# Altium project BMSV2.PrjPcb
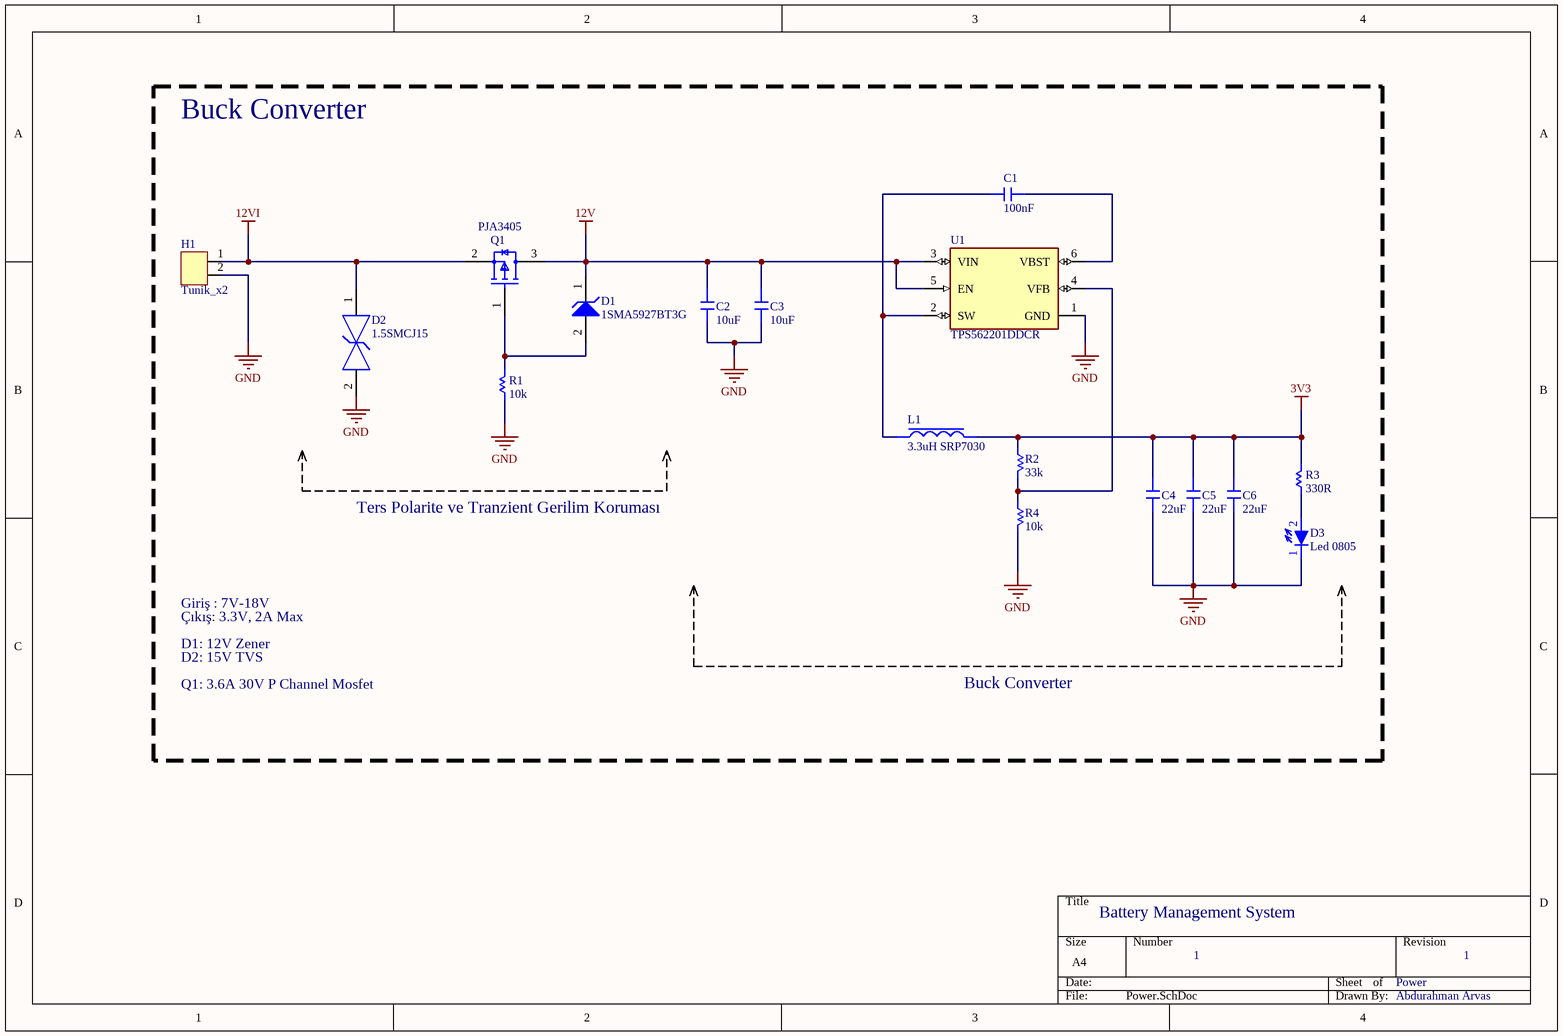
[diagram p0: Power.SchDoc]
5 sheets, 112 parts. Net scope: flat (ports and power ports of the same name join across sheets).
Board file: BMSV2.PcbDoc
Sheets:
  Power.SchDoc
  MCU.SchDoc
  Voltage_Measurement.SchDoc
  Overcurrent_Protection.SchDoc
  Cell_Balancing.SchDoc

## Sheet Power.SchDoc
size A4; SheetNumber: 1; SheetTotal: 5

### Parts
C1  100nF  [C0805]
C2  10uF  [C0805]
C3  10uF  [C0805]
C4  22uF  [C0805]
C5  22uF  [C0805]
C6  22uF  [C0805]
D1  1SMA5927BT3G  [ONSC-SMA-2-403D-02_F_V]
D2  1.5SMCJ15  [FP-SMC-MFG]
D3  Led 0805  [LED_0805]
H1  Tunik_x2  [2li_Tunik]
L1  3.3uH SRP7030  [Fıxed_Inductor_7.3x7x3]
Q1  PJA3405  [FP-SOT23-MFG]
R1  10k  [R0805]
R2  33k  [R0805]
R3  330R  [R0805]
R4  10k  [R0805]
U1  TPS562201DDCR  [FP-DDC0006A-IPC_A]

### Nets
3V3: C4.2 C5.2 C6.2 L1.2 R2.1 R3.2
12V: C2.2 C3.2 D1.1(K) Q1.3(D) U1.3(VIN) U1.5(EN)
12VI: D2.1 H1.1 Q1.2(S)
GND: C2.1 C3.1 C4.1 C5.1 C6.1 D2.2 D3.1(Cathode) H1.2 R1.1 R4.2 U1.1(GND)
NetC1_1: C1.1 U1.6(VBST)
NetC1_2: C1.2 L1.1 U1.2(SW)
NetD1_2: D1.2(A) Q1.1(G) R1.2
NetD3_2: D3.2(Anode) R3.1
NetR2_2: R2.2 R4.1 U1.4(VFB)

### Notes on the sheet
- Buck Converter
- Ters Polarite ve Tranzient Gerilim Koruması
- Giriş : 7V-18V
- Çıkış: 3.3V, 2A Max
- D1: 12V Zener
- D2: 15V TVS
- Q1: 3.6A 30V P Channel Mosfet
- Battery Management System
- 1
- Power
- Abdurahman Arvas

### Library data of the parts
C1-C6 = SMD_Capacitor
D1 = CMP-1060-00103-1: 1.5 W Zener Voltage Regulator, 2-Pin SMA, Pb-Free, Tape and Reel; Manufacturer: On Semiconductor; VZ Typ (V): 12; DatasheetVersion: Rev. 8; Mounting Technology: Surface Mount; RoHS: Pb-Free; Packing: Tape and Reel; ComponentLink2Description: Datasheet; ComponentLink1URL: http://www.onsemi.com/; PackageDescription: 2-Pin Small Molded Package, J-Bend Lead, Body 2.605 x 4.315 mm; PackageReference: SMA-2-403D-02_F; PartNumber: 1SMA5927BT3G; ComponentLink3URL: http://www.onsemi.com/pub_link/Collateral/1SMA5913BT3-D.PDF; ComponentLink1Description: Manufacturer URL; ComponentLink2URL: http://www.onsemi.com/pub_link/Collateral/1SMA5913BT3-D.PDF; PackageVersion: Rev. F, 11/2008; ComponentLink3Description: Package Specification
D2 = CMP-12225-000018-1: TVS DIODE 12V 19.9V SMC; Manufacturer: STMicroelectronics; Manufacturer Part Number: SMC30J12CA; Peak Pulse Power: 3000W; Number Of Channels: 1; Standoff Height: 0.05mm; Breakdown Voltage: 13.3V; Peak Pulse Current: 151A; Direction: Bidirectional; Max Junction Temp: +175°C; Temperature Range Low: -55°C; Package: SMC; Temperature Range High: +175°C; ComponentLink2Description: Datasheet; Temperature: -55°C to +175°C; Digikey Description: TVS DIODE 12V 19.9V SMC; Device Class L3: unset; Category: Diode; Reverse Standoff Voltage: 12V; Height: 2.65mm; Device Class L1: Circuit Protection; ComponentLink2URL: https://www.st.com/resource/en/datasheet/smc30j.pdf; Device Class L2: TVS Diodes; Automotive: No; Lead Free: Yes; Clamping Voltage: 19.9V; RoHS: TRUE; Octopart: https://octopart.com/smc30j12ca-stmicroelectronics-21709983
D3 = Led 0805: Light Emitting Diode with 0805 Footprint.
H1 = 2Li_Tunik: Value: 2 pin; Datasheet: https://cdn.ozdisan.com/ETicaret_Dosya/34800_4832773.pdf; Buy Link: https://ozdisan.com/konnektor-ve-baglanti-elemanlari/konnektor-cesitleri/pcb-konnektorler/TMK2002
L1 = Fixed_Inductor: Fixed Inductor
Q1 = CMP-12801-000074-1: MOSFET P-CH 60V 0.9A SOT23-3; Current Rating: -1.1A; Threshold Voltage: -3V; Gate to Source Voltage (Vgs): 20V; Number of Elements: 1; On-State Resistance: 600mR; Power Dissipation: 806mW; Element Configuration: Single; Drain to Source Voltage (Vdss): -60V; Input Capacitance: 219pF; Continuous Drain Current (ID): 1.1A; Max Power Dissipation: 625mW; Turn-On Delay Time: 1.6ns; Rise Time: 2.2ns; Rds On Max: 400mR; Turn-Off Delay Time: 11.2ns; Fall Time: 5.7ns; Min Operating Temperature: -55°C; Width: 1.4mm; Package Quantity: 3000; Case/Package: SOT-23; Lead Free: Lead Free; Packaging: Tape and Reel; Mount: Surface Mount; Height: 1.02mm; Length: 3.04mm; Weight: 0.000282oz; Drain to Source Resistance: 600mR; Contact Plating: Tin; Max Operating Temperature: 150°C; Radiation Hardening: No; REACH SVHC: No SVHC; Number of Pins: 3; Voltage Rating (DC): -60V; Number of Channels: 1
R1-R4 = SMD Resistor: SMD Chip Resistor
U1 = CMP-04918-000361-1: IC REG BUCK ADJ 2A TSOT23-6; Switching Frequency: 580kHz; Max Input Voltage: 17V; Number of Outputs: 1; Output Voltage: 7V; Output Type: Adjustable; Quiescent Current: 400uA; Min Input Voltage: 4.5V; Mount: Surface Mount; Max Operating Temperature: 125°C; Lead Free: Lead Free; Operating Supply Voltage: 17V; Number of Pins: 6; RoHS Compliant: Yes; Contact Plating: Tin; Min Operating Temperature: -40°C; Case/Package: SOT; Max Output Current: 2A

## Sheet MCU.SchDoc
size A4; SheetNumber: 2; SheetTotal: 5
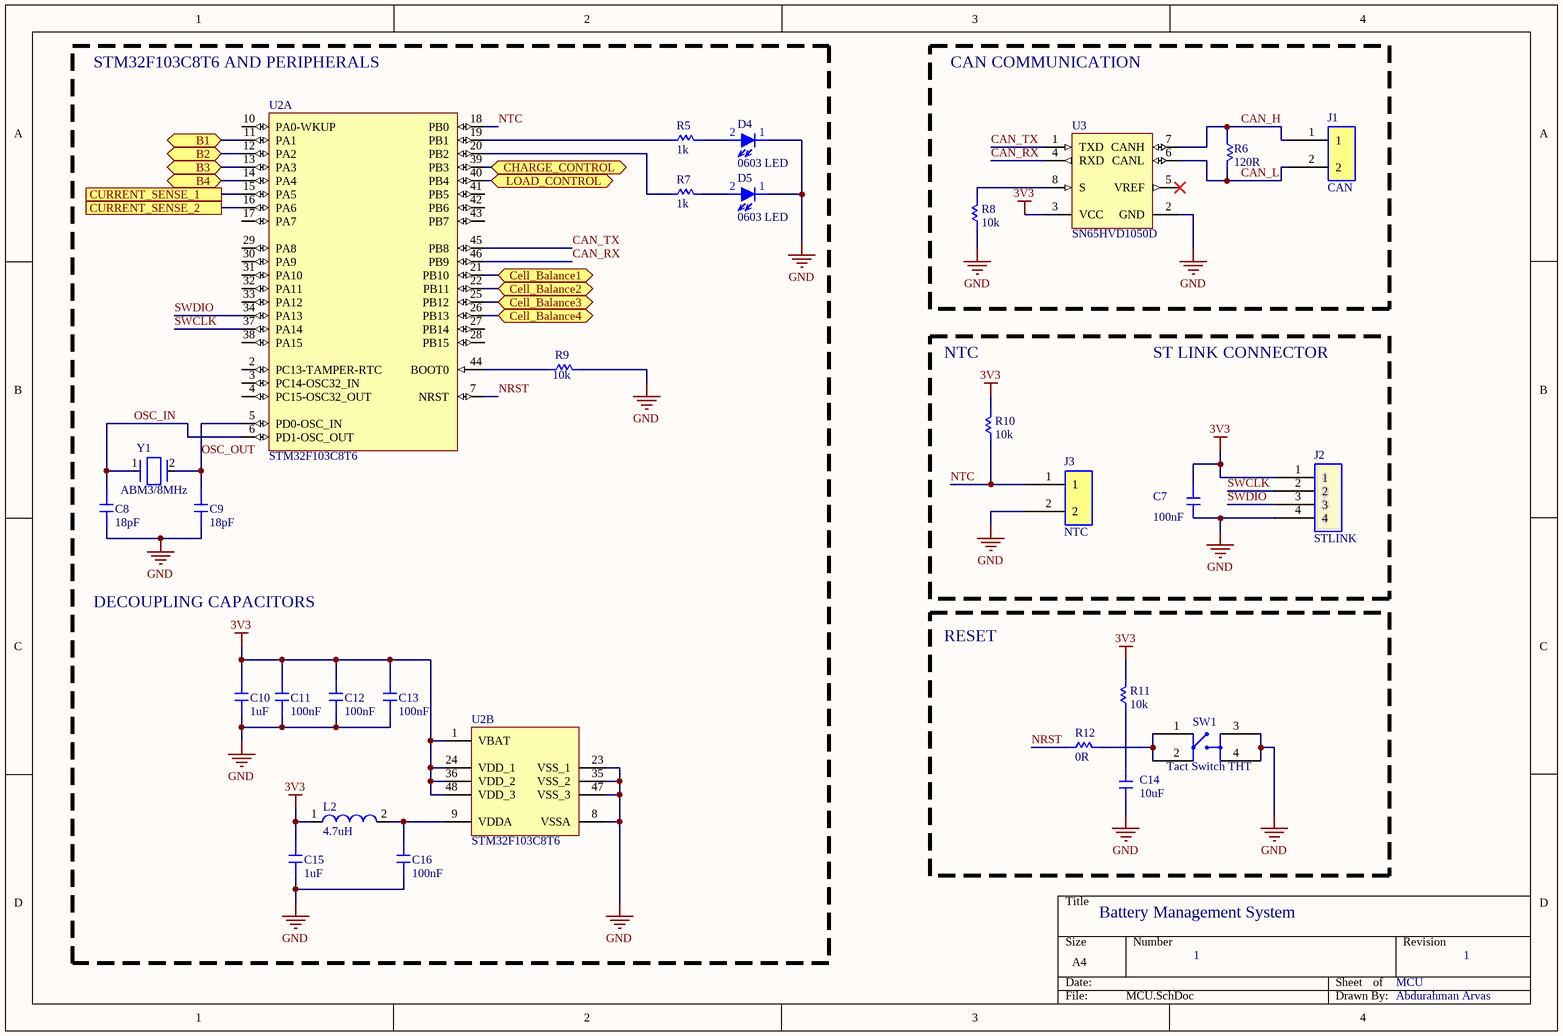
[diagram p1: MCU.SchDoc]

### Parts
C7  100nF  [C0805]
C8  18pF  [C0603]
C9  18pF  [C0603]
C10  1uF  [C0805]
C11  100nF  [C0805]
C12  100nF  [C0805]
C13  100nF  [C0805]
C14  10uF  [C0805]
C15  1uF  [C0805]
C16  100nF  [C0805]
D4  0603 LED  [LED_0603]
D5  0603 LED  [LED_0603]
J1  CAN  [CONN X2]
J2  STLINK  [CONN X4]
J3  NTC  [CONN X2]
L2  4.7uH  [SMD-0805]
R5  1k  [R0603]
R6  120R  [R0805]
R7  1k  [R0603]
R8  10k  [R0805]
R9  10k  [R0805]
R10  10k  [R0805]
R11  10k  [R0805]
R12  0R  [R0805]
SW1  Tact Switch THT  [Tact Switch 6x6 mm]
U2  STM32F103C8T6  [STM-LQFP48_L]  (parts A,B of 2)
U3  SN65HVD1050D  [D0008A_N]
Y1  ABM3/8MHz  [FP-ABM3-MFG]

### Blocks framed on the sheet
CAN COMMUNICATION: J1 R6 R8 U3
RESET: C14 R11 R12 SW1

### Ports
B1 (bidir), B2 (bidir), B3 (bidir), B4 (bidir), Cell_Balance1 (bidir), Cell_Balance2 (bidir), Cell_Balance3 (bidir), Cell_Balance4 (bidir), CHARGE_CONTROL (bidir), CURRENT_SENSE_1, CURRENT_SENSE_2, LOAD_CONTROL (bidir)

### Nets
3V3: C7.2 C10.2 C11.2 C12.2 C13.2 C15.2 J2.1 L2.1 R10.2 R11.2 U2.1(VBAT) U2.24(VDD_1) U2.36(VDD_2) U2.48(VDD_3) U3.3(VCC)
GND: C7.1 C8.1 C9.1 C10.1 C11.1 C12.1 C13.1 C14.1 C15.1 C16.1 D4.1(Cathode) D5.1(Cathode) J2.4 J3.2 R8.1 R9.2 SW1.3 SW1.4 U2.8(VSSA) U2.23(VSS_1) U2.35(VSS_2) U2.47(VSS_3) U3.2(GND)
CAN_H: J1.1 R6.1 U3.7(CANH)
CAN_L: J1.2 R6.2 U3.6(CANL)
CAN_RX: U2.46(PB9) U3.4(RXD)
CAN_TX: U2.45(PB8) U3.1(TXD)
NRST: R12.1 U2.7(NRST)
NTC: J3.1 R10.1 U2.18(PB0)
OSC_IN: C8.2 U2.6(PD1-OSC_OUT) Y1.1
OSC_OUT: C9.2 U2.5(PD0-OSC_IN) Y1.2
SWCLK: J2.2 U2.37(PA14)
SWDIO: J2.3 U2.34(PA13)
NetC14_2: C14.2 R11.1
NetC16_2: C16.2 L2.2 U2.9(VDDA)
NetC17_2: U2.11(PA1) ; port B1
NetC18_2: U2.12(PA2) ; port B2
NetC19_2: U2.13(PA3) ; port B3
NetC20_2: U2.14(PA4) ; port B4
NetD4_2: D4.2(Anode) R5.2
NetD5_2: D5.2(Anode) R7.2
NetQ4_1: U2.39(PB3) ; port CHARGE_CONTROL
NetQ5_1: U2.40(PB4) ; port LOAD_CONTROL
NetQ8_1: U2.22(PB11) ; port Cell_Balance2
NetQ9_1: U2.21(PB10) ; port Cell_Balance1
NetQ12_1: U2.26(PB13) ; port Cell_Balance4
NetQ13_1: U2.25(PB12) ; port Cell_Balance3
NetR5_1: R5.1 U2.19(PB1)
NetR7_1: R7.1 U2.20(PB2)
NetR8_2: R8.2 U3.8(S)
NetR9_1: R9.1 U2.44(BOOT0)
NetR12_2: R12.2 SW1.1 SW1.2
NetU2_15: U2.15(PA5) ; port CURRENT_SENSE_1
NetU2_16: U2.16(PA6) ; port CURRENT_SENSE_2

Not connected (* = marked no-connect by the designer): U2 2(PC13-TAMPER-RTC) 3(PC14-OSC32_IN) 4(PC15-OSC32_OUT) 10(PA0-WKUP) 17(PA7) 27(PB14) 28(PB15) 29(PA8) 30(PA9) 31(PA10) 32(PA11) 33(PA12) 38(PA15) 41(PB5) 42(PB6) 43(PB7); U3 5(VREF)*

### Notes on the sheet
- STM32F103C8T6 AND PERIPHERALS
- NTC
- ST LINK CONNECTOR
- DECOUPLING CAPACITORS
- Battery Management System
- 1
- MCU
- Abdurahman Arvas

### Library data of the parts
C7-C16 = SMD_Capacitor
D4 D5 = Led 0603: Light Emitting Diode with 0603 footprint.
J1 J3 = CONN X2_1: İki Pin Connector
J2 = CONN X4: x4 Pin Header
L2 = CMP-0221-00012-1: SMD-Multilayer Inductor WE-MI, L = 1.00 µH; Inductance: 1.00 ÂµH; ComponentLink2URL: http://www.we-online.de/katalog/media/pdf/7447905.pdf; ComponentLink1Description: Manufacturer Link; ComponentLink2Description: Datasheet; DatasheetVersion: ver 4, Oct-2004; PackageVersion: 2005; PackageReference: SMD-0805; ComponentLink1URL: http://www.we-online.com; PackageDescription: Chip Inductor, 2-Leads, Body 2.0 x 1.2 mm
R5-R12 = SMD Resistor: SMD Chip Resistor
SW1 = Tact Switch THT: Tact Switch 6x6 mm
U2 = CMP-0237-00215-3: ARM Cortex-M3 32-bit MCU, 64 KB Flash, 20 KB Internal RAM, 37 I/Os, 48-pin LQFP, -40 to 85 degC, Tray; Supply Voltage(Vcc) min (V): 2; Internal RAM Size (kB): 20; FLASH Size (Prog) (kB): 64; A/D Converter: 2x12-bit (10 Channel); I/Os (High Current): 37; Operating Frequency(F) (Processor speed) (MHz): 72; Core: ARM Cortex-M3; ComponentLink3Description: Package Specification; Mounting Technology: Surface Mount; PartNumber: STM32F103C8T6; PackageReference: LQFP48; Packing: Tray; ComponentLink3URL: http://www.st.com/st-web-ui/static/active/en/resource/technical/document/datasheet/DM00058181.pdf; DatasheetVersion: Rev. 16; ComponentLink1URL: http://www.st.com/web/en/home.html; PackageVersion: Rev. 6, 06/2013; ComponentLink2URL: http://www.st.com/st-web-ui/static/active/en/resource/technical/document/datasheet/CD00161566.pdf; ComponentLink1Description: Manufacturer URL; ComponentLink2Description: Datasheet; PackageDescription: 48-Pin Low Profile Quad Flat Package, 7 x 7 mm Body, 0.5 mm Pitch
U3 = CMP-0315-00048-2: High-Speed EMC Optimized CAN Transceiver, 70 mA, 5 V, -40 to 125 degC, 8-pin SOIC (D), Green (RoHS & no Sb/Br); Manufacturer: Texas Instruments; Bus Fault Voltage(V): -4 to 16; Rating: Catalog; Drivers Per Package: 1; Transient Pulse Protection(V): -200 to 200; ICC(Max)(mA): 70; Supply Voltage(s)(V): 5; PackageVersion: revM, Jun-2011; PartNumber: SN65HVD1050D; PackageReference: D0008A; Code_JEDEC: MS-012AA; Isolated: No; ComponentLink1Description: Datasheet; PackageDescription: 8-Pin Plastic Small Outline Integrated Circuit, 4.9 x 3.9 mm, Pitch 1.27 mm Pitch; Receivers Per Package: 1; Footprint: TJA1050; DatasheetVersion: SLLS632B; SubFamily: CAN; ComponentLink1URL: http://www.ti.com/general/docs/lit/getliterature.tsp?genericPartNumber=SN65HVD1050&fileType=pdf; Eco-Plan: Green (RoHS & no Sb/Br); Mounting Technology: Surface Mount
Y1 = CMP-2000-05033-2: Crystal 8MHz ±20ppm 18pF SMD-2 5mm x 3.2mm; Series Resistance: 500R; Frequency Stability: 30ppm; ESR (Equivalent Series Resistance): 140R; Load Capacitance: 18pF; Height: 0.051inch; Tolerance: 20ppm; Depth: 3.2mm; Max Operating Temperature: 85°C; Frequency: 8MHz; Termination: SMD/SMT; Lead Free: Lead Free; Number of Pins: 2; Width: 3.2mm; RoHS Compliant: Yes; Resistor Type: Ceramic; Length: 5mm; Mount: Surface Mount; Case/Package: CSMD; Package Quantity: 1000; Radiation Hardening: No; Min Operating Temperature: -40°C; Packaging: Tape and Reel; Frequency Tolerance: 20ppm

## Sheet Voltage_Measurement.SchDoc
size A4; SheetNumber: 3; SheetTotal: 5
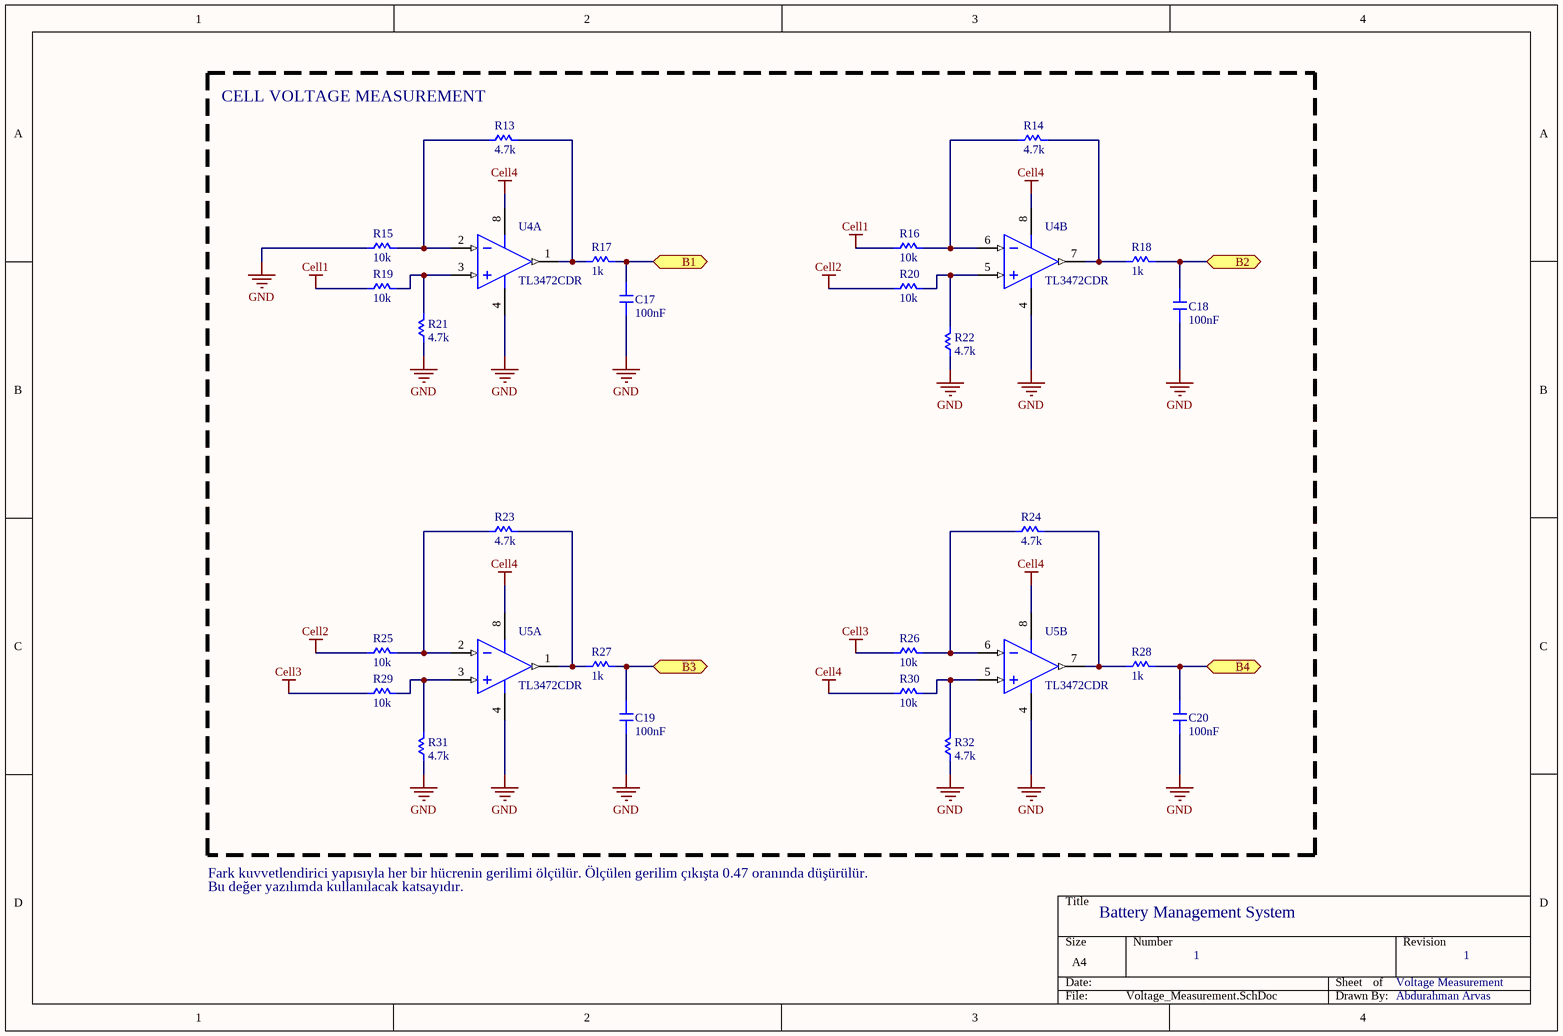
[diagram p2: Voltage_Measurement.SchDoc]

### Parts
C17  100nF  [C0805]
C18  100nF  [C0805]
C19  100nF  [C0805]
C20  100nF  [C0805]
R13  4.7k  [R0805]
R14  4.7k  [R0805]
R15  10k  [R0805]
R16  10k  [R0805]
R17  1k  [R0805]
R18  1k  [R0805]
R19  10k  [R0805]
R20  10k  [R0805]
R21  4.7k  [R0805]
R22  4.7k  [R0805]
R23  4.7k  [R0805]
R24  4.7k  [R0805]
R25  10k  [R0805]
R26  10k  [R0805]
R27  1k  [R0805]
R28  1k  [R0805]
R29  10k  [R0805]
R30  10k  [R0805]
R31  4.7k  [R0805]
R32  4.7k  [R0805]
U4  TL3472CDR  [D0008A_L]  (parts A,B of 2)
U5  TL3472CDR  [D0008A_L]  (parts A,B of 2)

### Blocks framed on the sheet
CELL VOLTAGE MEASUREMENT: C17-C20 R13-R32 U4 U5

### Ports
B1 (bidir), B2 (bidir), B3 (bidir), B4 (bidir)

### Nets
Cell1: R16.1 R19.1
Cell2: R20.1 R25.1
Cell3: R26.1 R29.1
Cell4: R30.1 U4.8(VCC+) U5.8(VCC+)
GND: C17.1 C18.1 C19.1 C20.1 R15.1 R21.1 R22.1 R31.1 R32.1 U4.4(VCC-/GND) U5.4(VCC-/GND)
NetC17_2: C17.2 R17.2 ; port B1
NetC18_2: C18.2 R18.2 ; port B2
NetC19_2: C19.2 R27.2 ; port B3
NetC20_2: C20.2 R28.2 ; port B4
NetR13_1: R13.1 R15.2 U4.2(IN1-)
NetR13_2: R13.2 R17.1 U4.1(OUT1)
NetR14_1: R14.1 R16.2 U4.6(IN2-)
NetR14_2: R14.2 R18.1 U4.7(OUT2)
NetR19_2: R19.2 R21.2 U4.3(IN1+)
NetR20_2: R20.2 R22.2 U4.5(IN2+)
NetR23_1: R23.1 R25.2 U5.2(IN1-)
NetR23_2: R23.2 R27.1 U5.1(OUT1)
NetR24_1: R24.1 R26.2 U5.6(IN2-)
NetR24_2: R24.2 R28.1 U5.7(OUT2)
NetR29_2: R29.2 R31.2 U5.3(IN1+)
NetR30_2: R30.2 R32.2 U5.5(IN2+)

### Notes on the sheet
- Fark kuvvetlendirici yapısıyla her bir hücrenin gerilimi ölçülür. Ölçülen gerilim çıkışta 0.47 oranında düşürülür.
- Bu değer yazılımda kullanılacak katsayıdır.
- Battery Management System
- 1
- Voltage Measurement
- Abdurahman Arvas

### Library data of the parts
C17-C20 = SMD_Capacitor
R13-R32 = SMD Resistor: SMD Chip Resistor
U4 U5 = CMP-0015-00034-2: High-Slew-Rate, Single-Supply Operational Amplifier, 4 to 36 V, 0 to 70 degC, 8-pin SOIC (D8), Green (RoHS & no Sb/Br); Manufacturer: Texas Instruments; Total Supply Voltage(Max)(+5V is 5, +/-5V is 10): 36; Number of Channels: 2; Slew Rate(Typ)(V/us): 13; IIB(Max)(pA): 500000; CMRR(Min)(dB): 65; Total Supply Voltage(Min)(+5V is 5, +/-5V is 10): 4; Rating: Catalog; Sub Family: General Purpose Amplifier, High Supply Voltage Amplifier (>=30V); Vn at 1kHz(Typ)(nV/rtHz): 49; Offset Drift(Typ)(uV/C): 10; Iq per channel(Max)(mA): 4.5; ComponentLink3URL: http://www.ti.com/litv/pdf/msoi002j; PackageDescription: 8-Pin Plastic Small Outline, Body 4.9 x 3.9 mm, Pitch 1.27 mm; DatasheetVersion: SLOS200G; ComponentLink3Description: Package Specification; PartNumber: TL3472CDR; ComponentLink2Description: Datasheet; Code_JEDEC: MS-012; Mounting Technology: Surface Mount; PackageReference: D0008A; GBW(Typ)(MHz): 4; PackageVersion: 4040047-3/M, 06/2011; ComponentLink2URL: http://www.ti.com/lit/ds/symlink/tl3472.pdf; ComponentLink1URL: http://www.ti.com/; Vio (25C)(Max)(mV): 10; Eco-Plan: Green (RoHS & no Sb/Br); ComponentLink1Description: Manufacturer URL

## Sheet Overcurrent_Protection.SchDoc
size A4; SheetNumber: 4; SheetTotal: 5
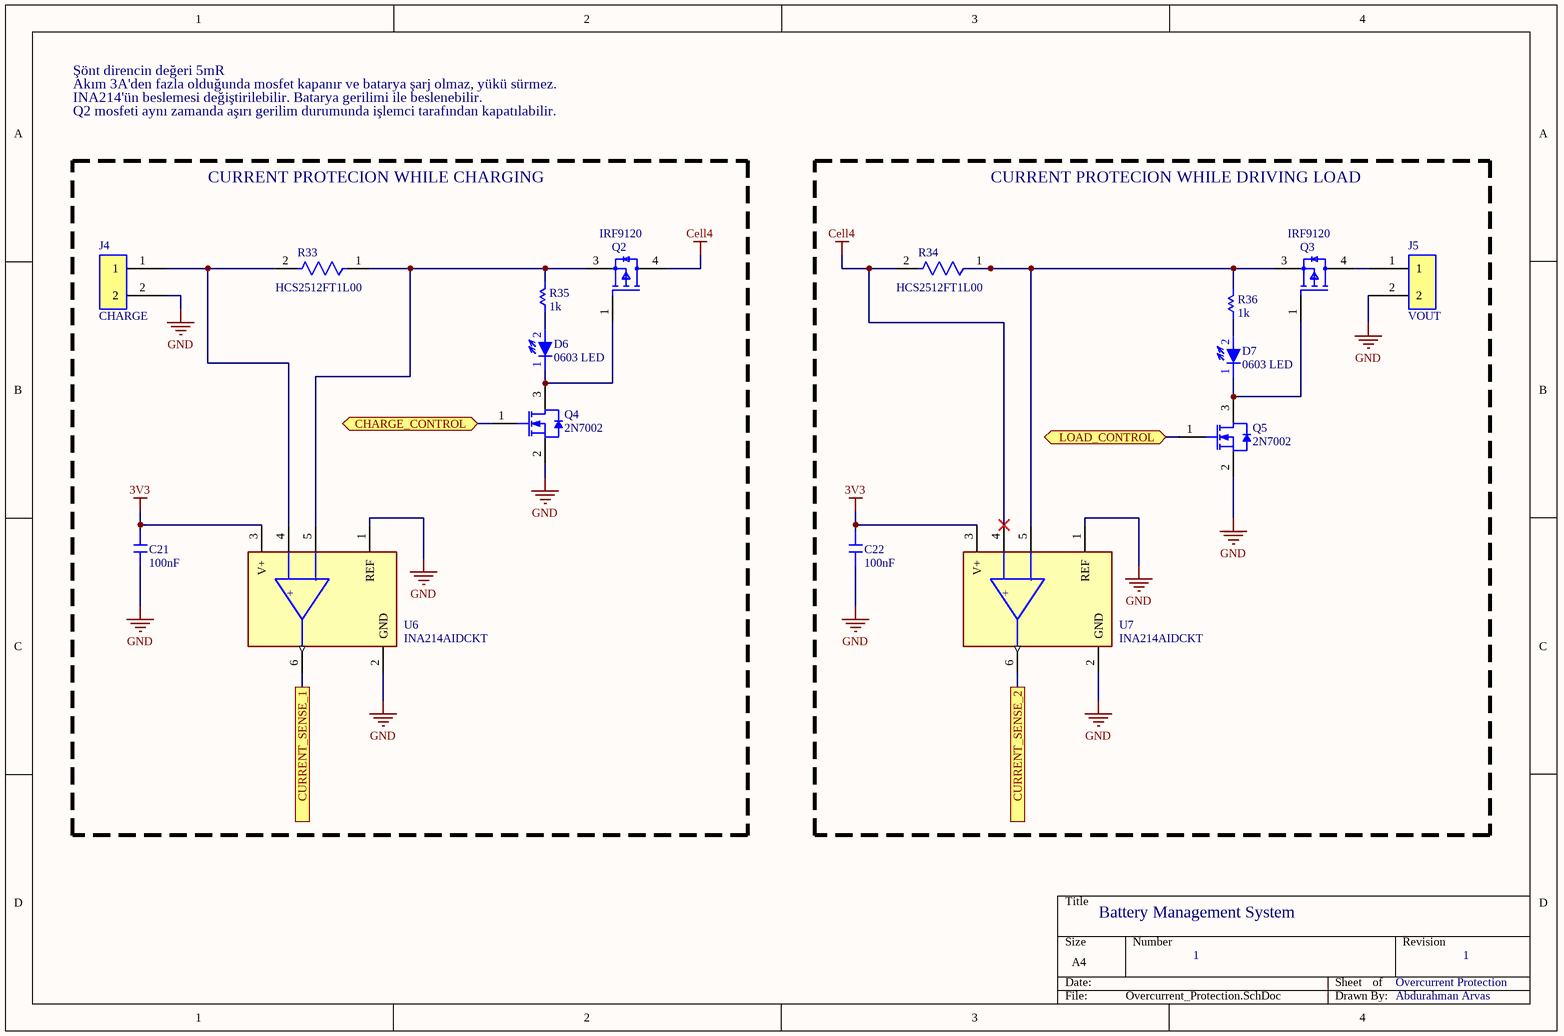
[diagram p3: Overcurrent_Protection.SchDoc]

### Parts
C21  100nF  [C0805]
C22  100nF  [C0805]
D6  0603 LED  [LED_0603]
D7  0603 LED  [LED_0603]
J4  CHARGE  [CONN X2]
J5  VOUT  [CONN X2]
Q2  IRF9120  [FP-TO-252-MFG]
Q3  IRF9120  [FP-TO-252-MFG]
Q4  2N7002  [STM-SOT-23-3_V]
Q5  2N7002  [STM-SOT-23-3_V]
R33  HCS2512FT1L00  [FP-HCS2512FT1L00-MFG]
R34  HCS2512FT1L00  [FP-HCS2512FT1L00-MFG]
R35  1k  [R0805]
R36  1k  [R0805]
U6  INA214AIDCKT  [FP-DCK0006A-MFG]
U7  INA214AIDCKT  [FP-DCK0006A-MFG]

### Blocks framed on the sheet
CURRENT PROTECION WHILE CHARGING: C21 D6 J4 Q2 Q4 R33 R35 U6
CURRENT PROTECION WHILE DRIVING LOAD: C22 D7 J5 Q3 Q5 R34 R36 U7

### Ports
CHARGE_CONTROL (bidir), CURRENT_SENSE_1, CURRENT_SENSE_2, LOAD_CONTROL (bidir)

### Nets
3V3: C21.2 C22.2 U6.3(V+) U7.3(V+)
Cell4: Q2.4(Drain) R34.2 U7.4(IN+)
GND: C21.1 C22.1 J4.2 J5.2 Q4.2(S) Q5.2(S) U6.1(REF) U6.2(GND) U7.1(REF) U7.2(GND)
NetD6_1: D6.1(Cathode) Q2.1(Gate) Q4.3(D)
NetD6_2: D6.2(Anode) R35.1
NetD7_1: D7.1(Cathode) Q3.1(Gate) Q5.3(D)
NetD7_2: D7.2(Anode) R36.1
NetJ4_1: J4.1 R33.2 U6.4(IN+)
NetJ5_1: J5.1 Q3.4(Drain)
NetQ2_3: Q2.3(Source) R33.1 R35.2 U6.5(IN-)
NetQ3_3: Q3.3(Source) R34.1 R36.2 U7.5(IN-)
NetQ4_1: Q4.1(G) ; port CHARGE_CONTROL
NetQ5_1: Q5.1(G) ; port LOAD_CONTROL
NetU2_15: U6.6(OUT) ; port CURRENT_SENSE_1
NetU2_16: U7.6(OUT) ; port CURRENT_SENSE_2

### Notes on the sheet
- Şönt direncin değeri 5mR
- Akım 3A'den fazla olduğunda mosfet kapanır ve batarya şarj olmaz, yükü sürmez.
- INA214'ün beslemesi değiştirilebilir. Batarya gerilimi ile beslenebilir.
- Q2 mosfeti aynı zamanda aşırı gerilim durumunda işlemci tarafından kapatılabilir.
- Battery Management System
- 1
- Overcurrent Protection
- Abdurahman Arvas
- (in symbol CMP-2000-06456-2) -; +

### Library data of the parts
C21 C22 = SMD_Capacitor
D6 D7 = Led 0603: as D4 on sheet MCU
J4 J5 = CONN X2: İki Pin Connector
Q2 Q3 = CMP-15615-000002-1: MOSFET P-CHANNEL 60V 20A TO252; Rds On Max: 48mR; Max Power Dissipation: 66W; Input Capacitance: 1.25nF; Mount: Surface Mount; Case/Package: TO-252-3; Min Operating Temperature: -50°C; Continuous Drain Current (ID): 20A; Drain to Source Voltage (Vdss): 60V; Packaging: Cut Tape; RoHS Compliant: Yes; Max Operating Temperature: 150°C
Q4 Q5 = CMP-0434-00001-1: N-channel 60 V, 1.8 Ohm, 0.35 A STripFET(TM) II Power MOSFET, SOT23; Manufacturer: STMicroelectronics; PartNumber: 2N7002; ComponentLink2Description: Datasheet; ComponentLink2URL: http://www.st.com/st-web-ui/static/active/en/resource/technical/document/datasheet/CD00005134.pdf; ComponentLink1Description: Manufacturer URL; ComponentLink1URL: http://www.st.com/; DatasheetVersion: Rev. 9, 11/2008; PackageReference: SOT-23; Mounting Technology: Surface Mount; PackageDescription: 3-Pin SOT23, 3.016 x 2.8 mm Body, 0.95 mm Pitch
R33 R34 = CMP-26527-002753-1: RES 0.001 OHM 1% 3W 2512; Temperature Coefficient: 100ppm/°C; Resistance: 1mR; Min Operating Temperature: -55°C; Features: Moisture Resistant; Number of Terminations: 2; RoHS Compliant: Yes; Resistor Type: Metal Element; Case/Package: 2512; Max Power Dissipation: 3W; Packaging: Tape and Reel; Height: 0.021inch; Tolerance: 1%; Max Operating Temperature: 170°C; Case Code (Imperial): 2512; Length: 0.256inch; Case Code (Metric): 6432; Width: 0.128inch; Package Quantity: 4000
R35 R36 = SMD Resistor: SMD Chip Resistor
U6 U7 = CMP-2000-06456-2: IC CURR SENSE 1 CIRCUIT SC70-6; Manufacturer: Texas Instruments; Voltage Gain: 0.1V/mV; Max Supply Voltage: 26V; Bandwidth: 30kHz; Number Of Channels: 1; Min Supply Voltage: 2.7V; Nominal Supply Current: 65uA; Max Junction Temp: +150°C; Input Offset Voltage: 0.001mV; Standoff Height: 0mm; Input Bias Current: 28uA; Device Class L1: Integrated Circuits (ICs); Device Class L2: Linear ICs; Height: 1.1mm; Temperature Range High: +125°C; Package: DCK0006A; RoHS: TRUE; Temperature: -40°C to +125°C; Automotive: No; Manufacturer Part Number: INA214AIDCKT; Device Class L3: Instrumentation; Mouser Description: Current Sense Amplifiers Hi/Lo-Side Bi-Dir 0- Drift Ser Crnt Shunt; Digikey Description: IC CURR SENSE 1 CIRCUIT SC70-6; ComponentLink2Description: Datasheet; Lead Free: Yes; Ambient Temperature Range High: +125°C; Temperature Range Low: -40°C; ComponentLink2URL: http://www.ti.com/lit/ds/symlink/ina214.pdf; Octopart: https://octopart.com/ina214aidckt-texas+instruments-7830703; Ambient Temperature Range Low: -40°C; Category: IC

## Sheet Cell_Balancing.SchDoc
size A4; SheetNumber: 5; SheetTotal: 5
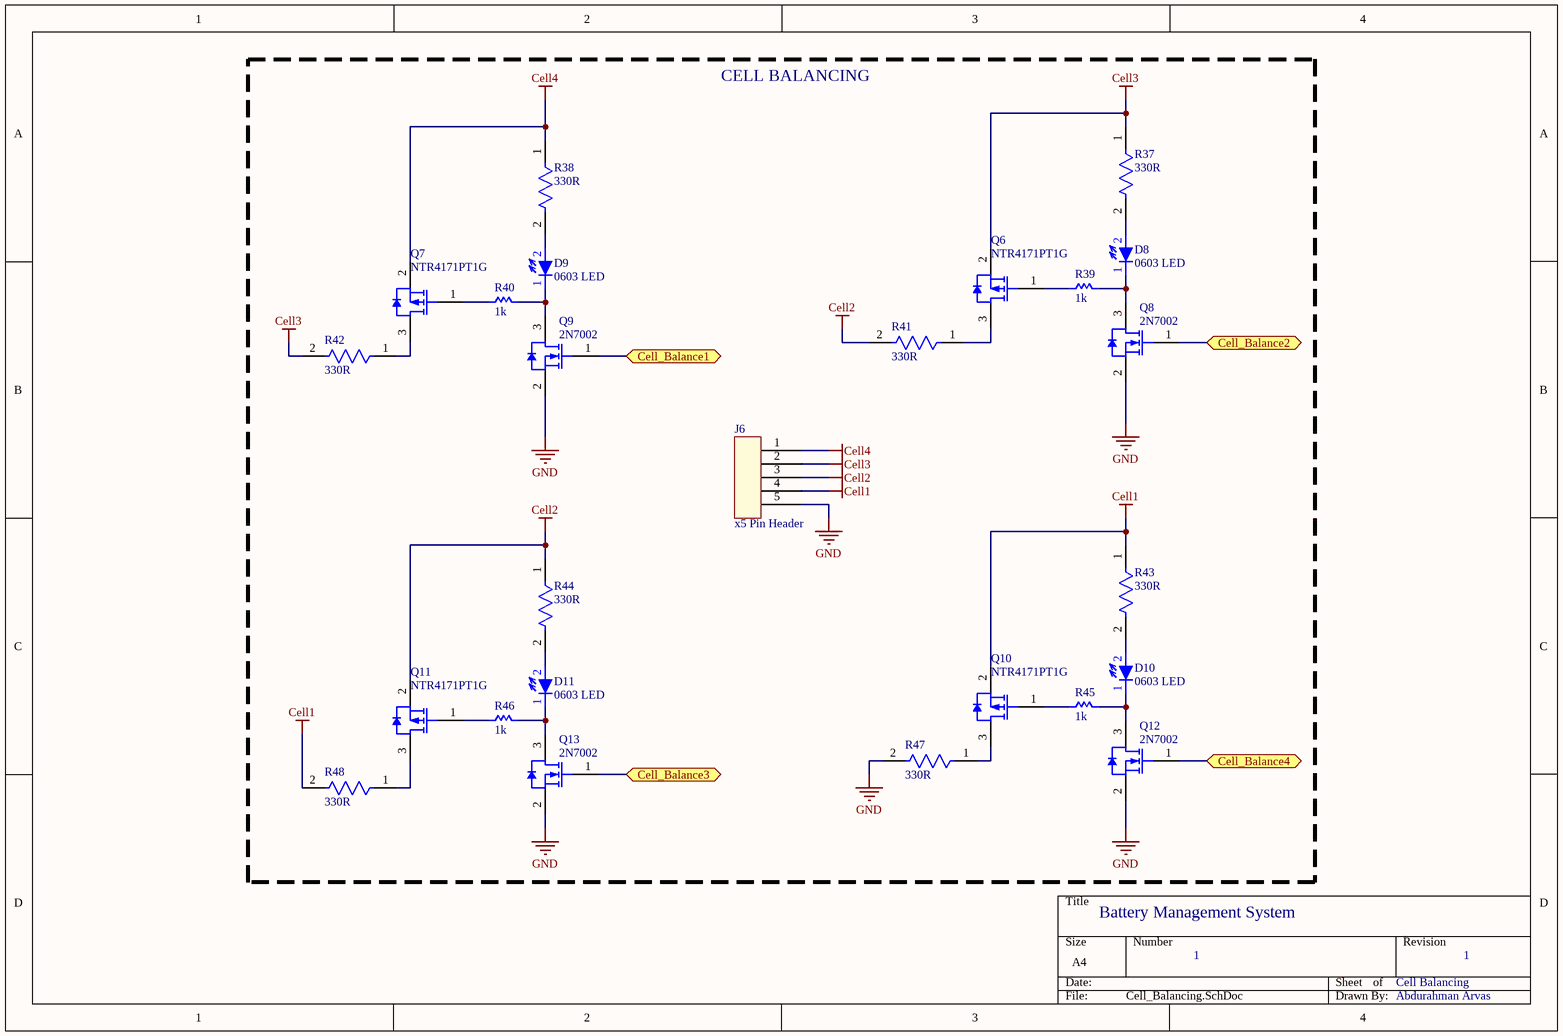
[diagram p4: Cell_Balancing.SchDoc]

### Parts
D8  0603 LED  [LED_0603]
D9  0603 LED  [LED_0603]
D10  0603 LED  [LED_0603]
D11  0603 LED  [LED_0603]
J6  x5 Pin Header  [CONN X5]
Q6  NTR4171PT1G  [ONSC-SOT-23-3-318-08_V]
Q7  NTR4171PT1G  [ONSC-SOT-23-3-318-08_V]
Q8  2N7002  [STM-SOT-23-3_V]
Q9  2N7002  [STM-SOT-23-3_V]
Q10  NTR4171PT1G  [ONSC-SOT-23-3-318-08_V]
Q11  NTR4171PT1G  [ONSC-SOT-23-3-318-08_V]
Q12  2N7002  [STM-SOT-23-3_V]
Q13  2N7002  [STM-SOT-23-3_V]
R37  330R  [FP-CRCW2512-e3-IPC_B]
R38  330R  [FP-CRCW2512-e3-IPC_B]
R39  1k  [R0805]
R40  1k  [R0805]
R41  330R  [FP-CRCW2512-e3-IPC_B]
R42  330R  [FP-CRCW2512-e3-IPC_B]
R43  330R  [FP-CRCW2512-e3-IPC_B]
R44  330R  [FP-CRCW2512-e3-IPC_B]
R45  1k  [R0805]
R46  1k  [R0805]
R47  330R  [FP-CRCW2512-e3-IPC_B]
R48  330R  [FP-CRCW2512-e3-IPC_B]

### Blocks framed on the sheet
CELL BALANCING: D8-D11 J6 Q6-Q13 R37-R48

### Ports
Cell_Balance1 (bidir), Cell_Balance2 (bidir), Cell_Balance3 (bidir), Cell_Balance4 (bidir)

### Nets
Cell1: J6.4 Q10.2(S) R43.1 R48.2
Cell2: J6.3 Q11.2(S) R41.2 R44.1
Cell3: J6.2 Q6.2(S) R37.1 R42.2
Cell4: J6.1 Q7.2(S) R38.1
GND: J6.5 Q8.2(S) Q9.2(S) Q12.2(S) Q13.2(S) R47.2
NetD8_1: D8.1(Cathode) Q8.3(D) R39.2
NetD8_2: D8.2(Anode) R37.2
NetD9_1: D9.1(Cathode) Q9.3(D) R40.2
NetD9_2: D9.2(Anode) R38.2
NetD10_1: D10.1(Cathode) Q12.3(D) R45.2
NetD10_2: D10.2(Anode) R43.2
NetD11_1: D11.1(Cathode) Q13.3(D) R46.2
NetD11_2: D11.2(Anode) R44.2
NetQ6_1: Q6.1(G) R39.1
NetQ6_3: Q6.3(D) R41.1
NetQ7_1: Q7.1(G) R40.1
NetQ7_3: Q7.3(D) R42.1
NetQ8_1: Q8.1(G) ; port Cell_Balance2
NetQ9_1: Q9.1(G) ; port Cell_Balance1
NetQ10_1: Q10.1(G) R45.1
NetQ10_3: Q10.3(D) R47.1
NetQ11_1: Q11.1(G) R46.1
NetQ11_3: Q11.3(D) R48.1
NetQ12_1: Q12.1(G) ; port Cell_Balance4
NetQ13_1: Q13.1(G) ; port Cell_Balance3

### Notes on the sheet
- Battery Management System
- 1
- Cell Balancing
- Abdurahman Arvas

### Library data of the parts
D8-D11 = Led 0603: as D4 on sheet MCU
J6 = CONN X5
Q6 Q7 Q10 Q11 = CMP-1058-00738-1: Power MOSFET, -30 V, 3.5 A, Single P-Channel, 3-Pin SOT-23, Pb-Free, Tape and Reel; Manufacturer: On Semiconductor; VGS Max (V): 12; V(BR)DSS Min (V): 30; Crss Typ (pF): 65; VGS(th) Max (V): 1.4; Ciss Typ (pF): 720; Qrr Typ (nC): 8; Coss Typ (pF): 95; Channel Polarity: P Channel; ComponentLink2URL: http://www.onsemi.cn/pub_link/Collateral/NTR4171P-D.PDF; ComponentLink1Description: Manufacturer URL; PartNumber: NTR4171PT1G; Mounting Technology: Surface Mount; ComponentLink1URL: http://www.onsemi.com/; Packing: Tape and Reel; Package Type: SOT-23-3; ComponentLink2Description: Datasheet; PackageReference: SOT-23-3-318-08; Configuration: Single; ComponentLink3Description: Package Specification; DatasheetVersion: Rev. 1; PackageVersion: Rev. AP, 11/2009; RoHS: Pb-Free; PackageDescription: 3-Pin Small Outline Transistor, Body 2.92 x 1.3 mm, Pitch 0.95 mm; ComponentLink3URL: http://www.onsemi.cn/pub_link/Collateral/318-08.PDF
Q8 Q9 Q12 Q13 = CMP-0434-00001-1: as Q4 on sheet Overcurrent_Protection; PartNumber: 2N7002; ComponentLink2Description: Datasheet; ComponentLink2URL: http://www.st.com/st-web-ui/static/active/en/resource/technical/document/datasheet/CD00005134.pdf; ComponentLink1Description: Manufacturer URL; ComponentLink1URL: http://www.st.com/; DatasheetVersion: Rev. 9, 11/2008; PackageReference: SOT-23; Mounting Technology: Surface Mount; PackageDescription: 3-Pin SOT23, 3.016 x 2.8 mm Body, 0.95 mm Pitch
R37 R38 R41-R44 R47 R48 = CMP-1018-00062-2: RES Thick Film, 330Ω, 5%, 1W, 200ppm/°C, 2512; Voltage Rating: 500V; Height: 0.6mm; Radiation Hardening: No; Resistance: 330R; Termination: Solder; Power Rating: 1W; Packaging: Tape and Reel; Max Operating Temperature: 155°C; Case Code (Imperial): 2512; Max Power Dissipation: 1W; Case Code (Metric): 6432; Case/Package: 2512; Width: 0.124inch; Temperature Coefficient: 200ppm/°C; Number of Terminations: 2; Length: 6.3mm; Contact Plating: Tin; Min Operating Temperature: -55°C; Military Standard: Not; Tolerance: 5%; Package Quantity: 1; Voltage Rating (DC): 500V; Composition: Thick Film; Lead Free: Lead Free; Depth: 3.15mm; Mount: Surface Mount; Weight: 0.001429oz; Number of Pins: 2; Features: Automotive AEC-Q200
R39 R40 R45 R46 = SMD Resistor: SMD Chip Resistor

## Nets that join several sheets
3V3: Power (6 pins), MCU (15 pins), Overcurrent_Protection (C21.2 C22.2 U6.3 U7.3)
Cell1: Voltage_Measurement (R16.1 R19.1), Cell_Balancing (J6.4 Q10.2 R43.1 R48.2)
Cell2: Voltage_Measurement (R20.1 R25.1), Cell_Balancing (J6.3 Q11.2 R41.2 R44.1)
Cell3: Voltage_Measurement (R26.1 R29.1), Cell_Balancing (J6.2 Q6.2 R37.1 R42.2)
Cell4: Voltage_Measurement (R30.1 U4.8 U5.8), Overcurrent_Protection (Q2.4 R34.2 U7.4), Cell_Balancing (J6.1 Q7.2 R38.1)
GND: Power (11 pins), MCU (23 pins), Voltage_Measurement (11 pins), Overcurrent_Protection (10 pins), Cell_Balancing (6 pins)
NetC17_2: MCU (U2.11), Voltage_Measurement (C17.2 R17.2)
NetC18_2: MCU (U2.12), Voltage_Measurement (C18.2 R18.2)
NetC19_2: MCU (U2.13), Voltage_Measurement (C19.2 R27.2)
NetC20_2: MCU (U2.14), Voltage_Measurement (C20.2 R28.2)
NetQ4_1: MCU (U2.39), Overcurrent_Protection (Q4.1)
NetQ5_1: MCU (U2.40), Overcurrent_Protection (Q5.1)
NetQ8_1: MCU (U2.22), Cell_Balancing (Q8.1)
NetQ9_1: MCU (U2.21), Cell_Balancing (Q9.1)
NetQ12_1: MCU (U2.26), Cell_Balancing (Q12.1)
NetQ13_1: MCU (U2.25), Cell_Balancing (Q13.1)
NetU2_15: MCU (U2.15), Overcurrent_Protection (U6.6)
NetU2_16: MCU (U2.16), Overcurrent_Protection (U7.6)